# EAGLE schematic hanover-7320-20-01 (EAGLE 9.6.1), part 2 of 4
## Sheet 5 of 7: Dots R1-16 C17-32
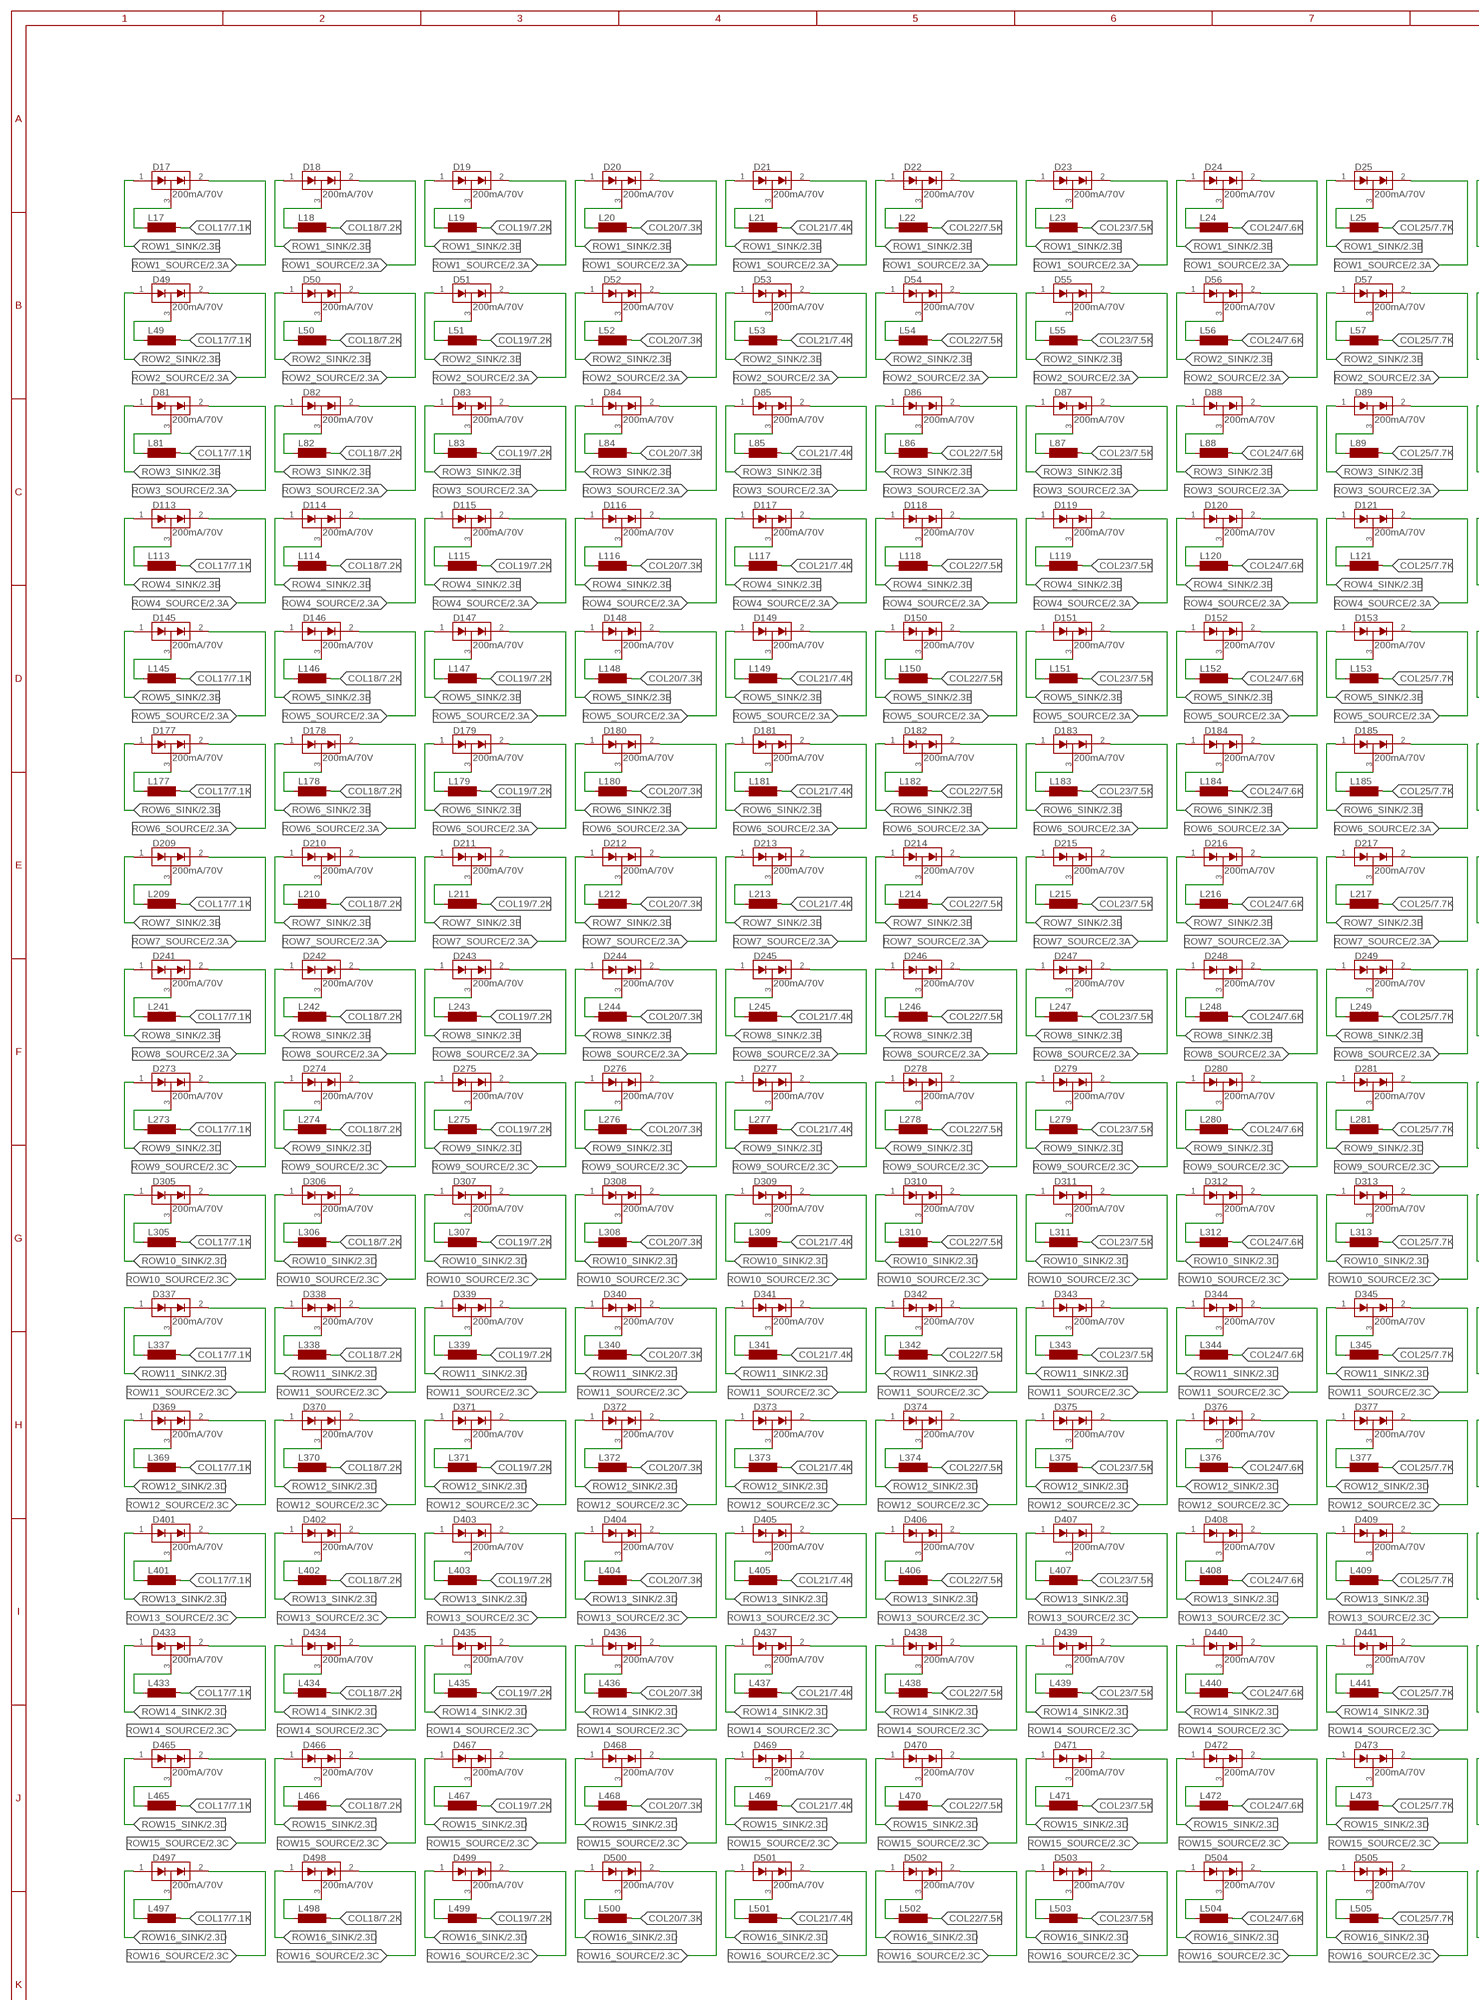
[diagram p6: schematic, sheet 5, part 1 of 3]
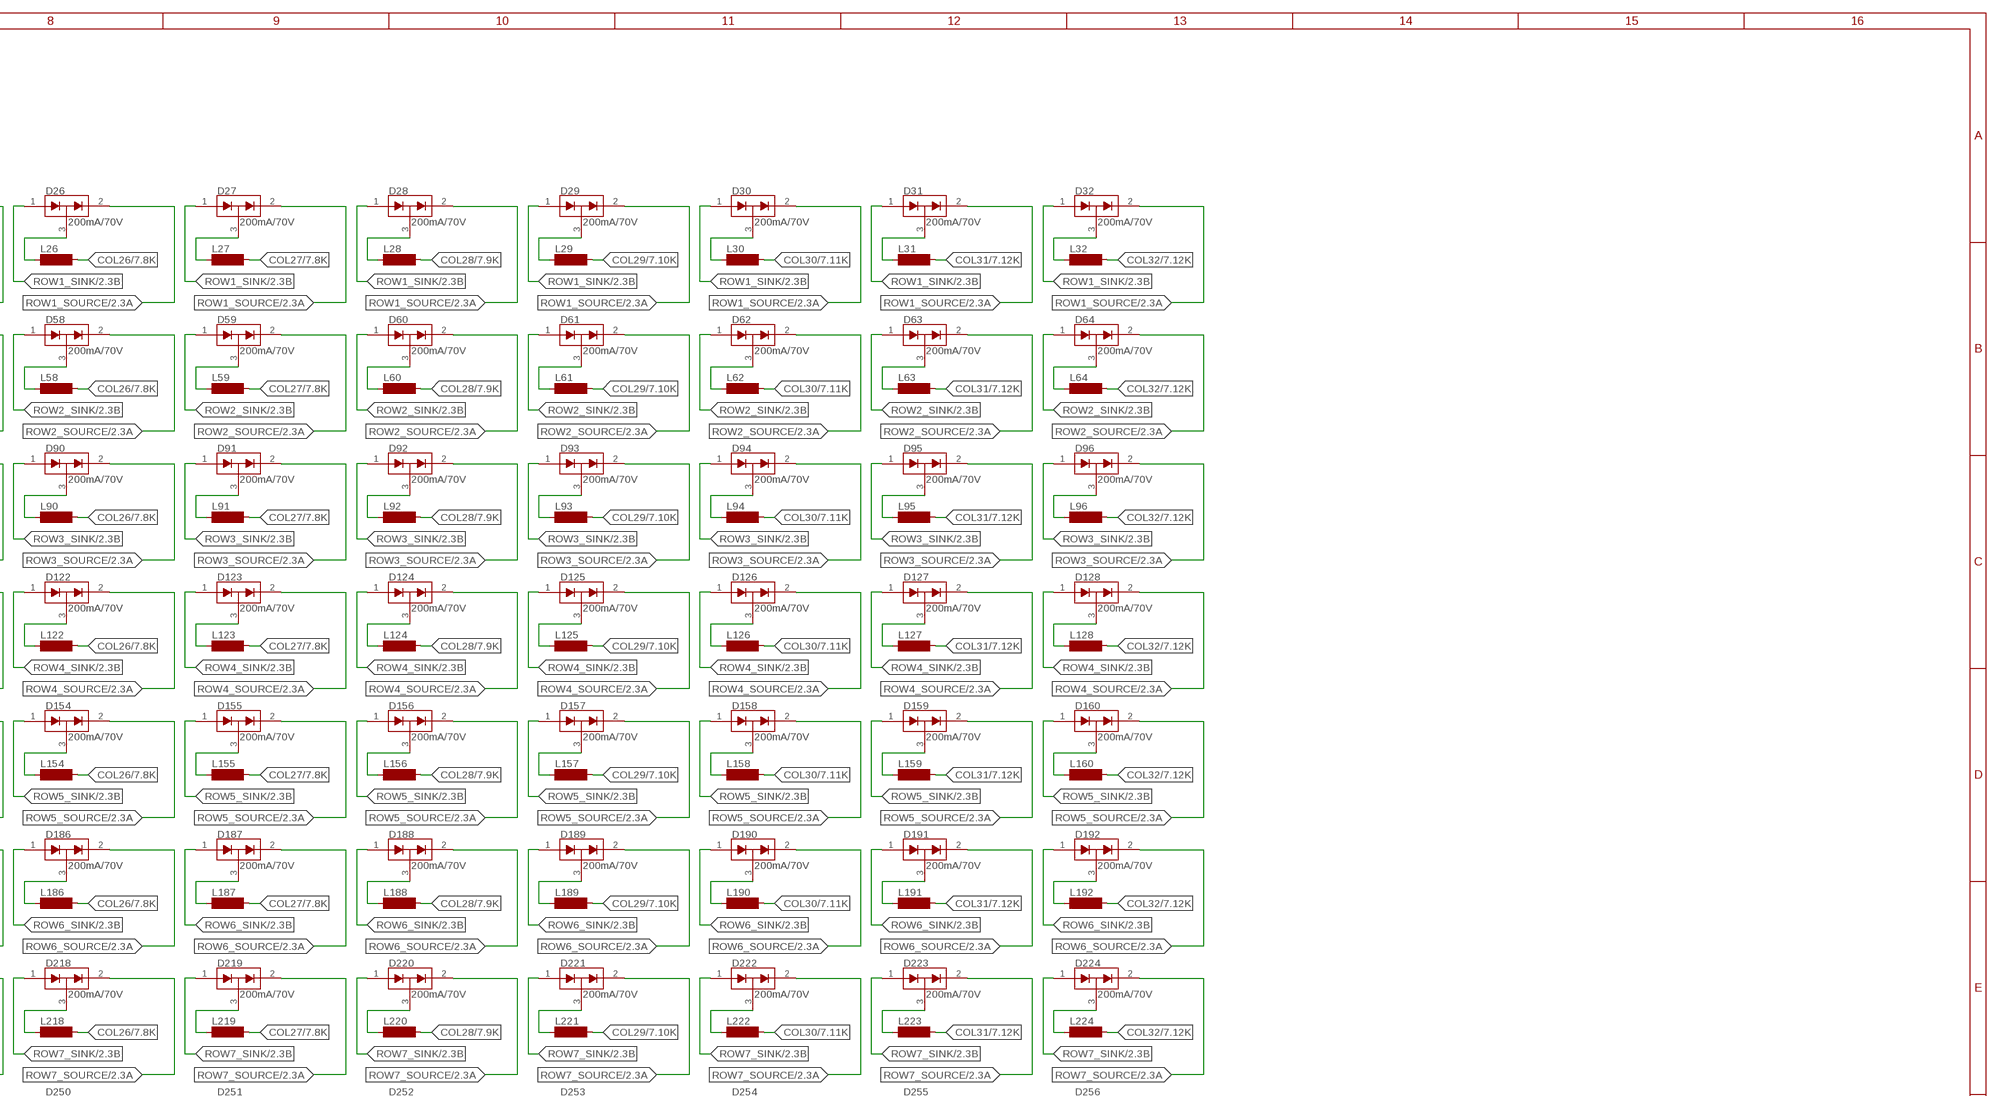
[diagram p7: schematic, sheet 5, part 2 of 3]
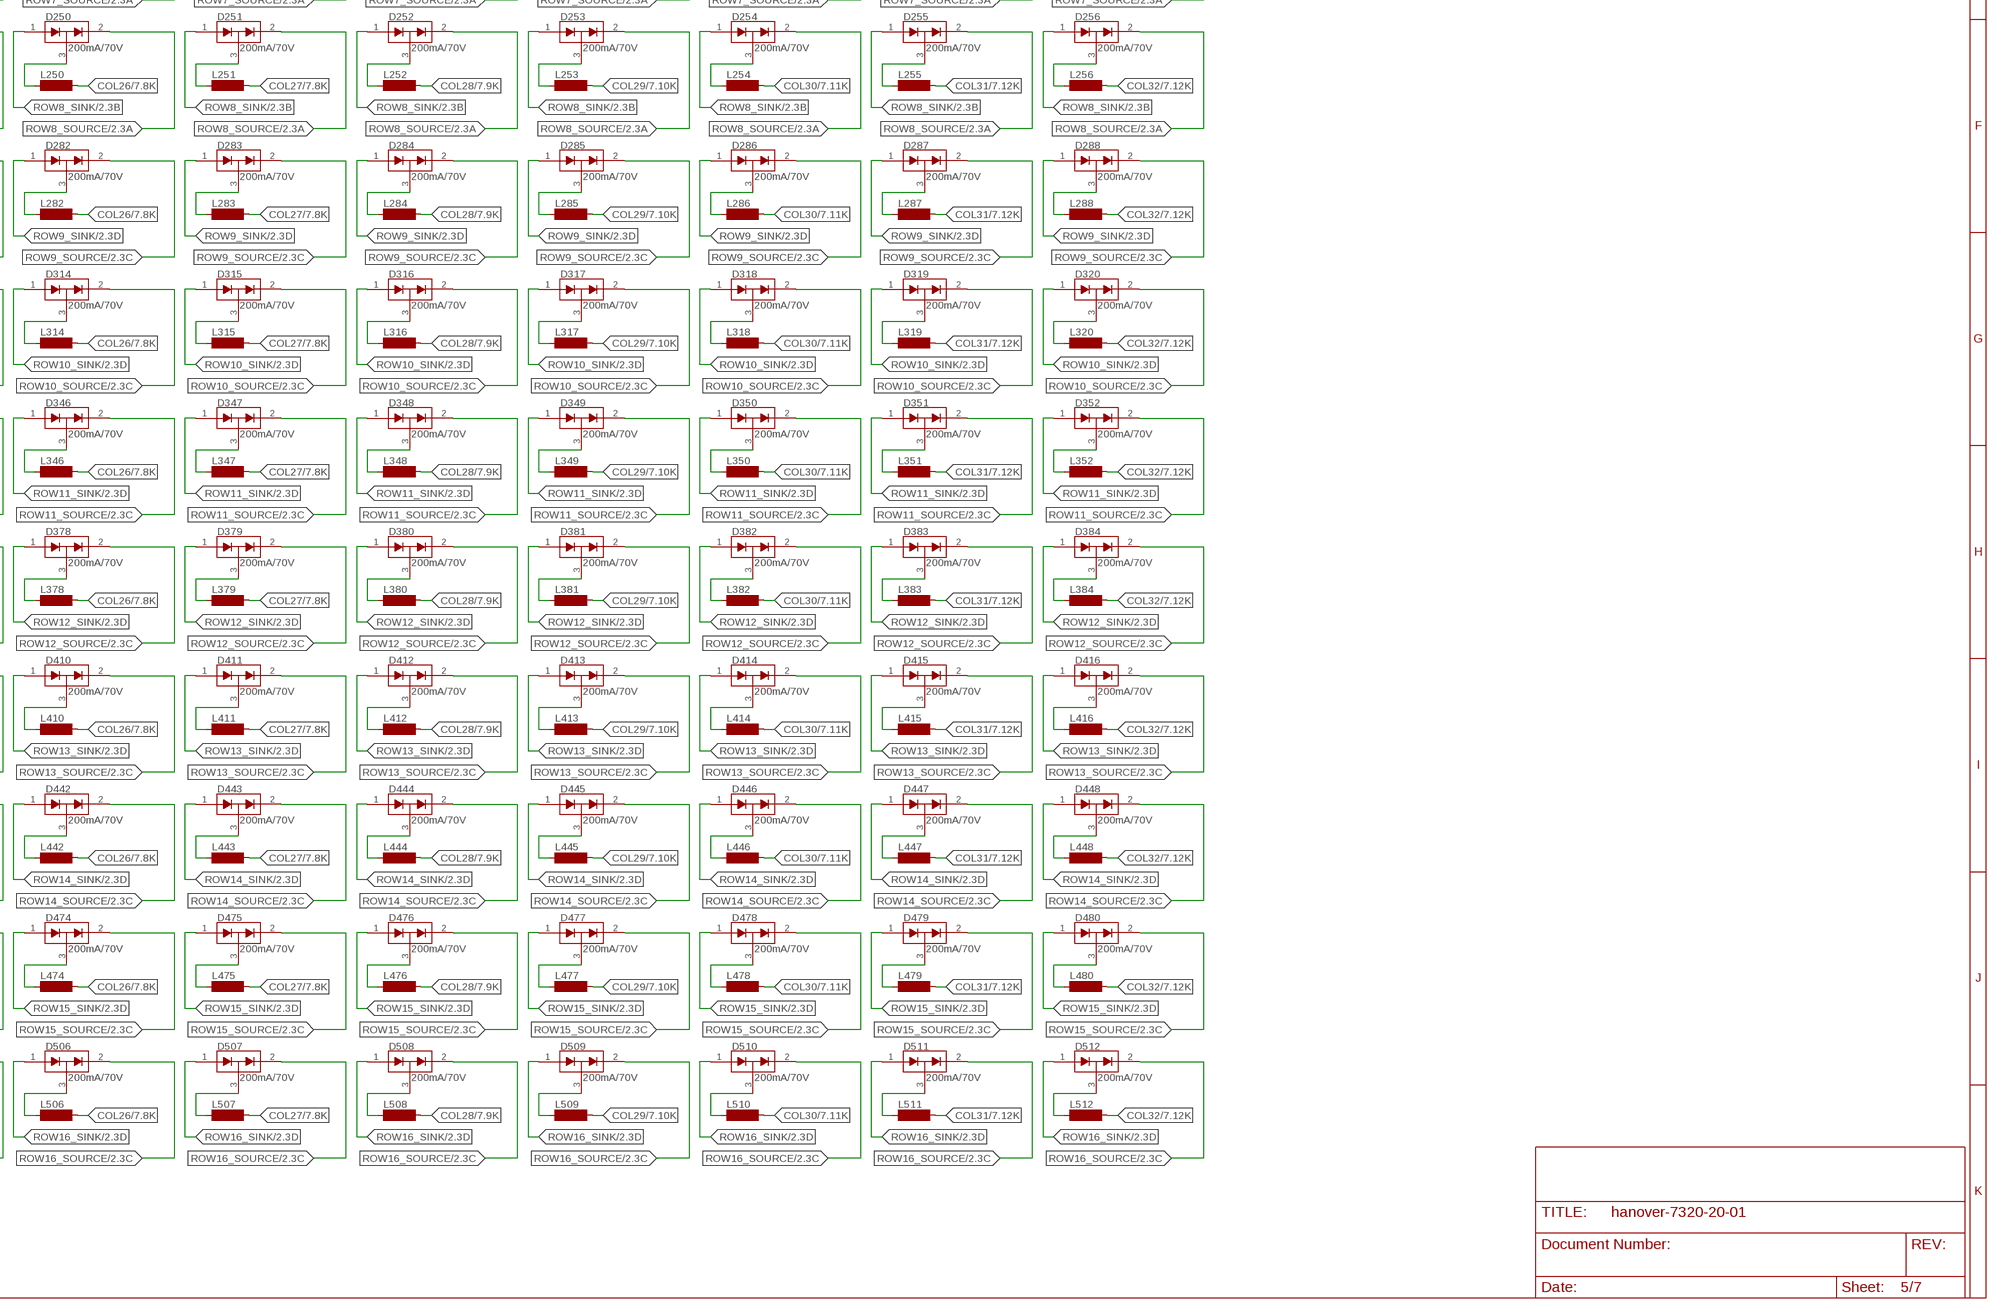
[diagram p8: schematic, sheet 5, part 3 of 3]

### Parts
D17  200mA/70V  BAV99  [SOT23-3]
D18  200mA/70V  BAV99  [SOT23-3]
D19  200mA/70V  BAV99  [SOT23-3]
D20  200mA/70V  BAV99  [SOT23-3]
D21  200mA/70V  BAV99  [SOT23-3]
D22  200mA/70V  BAV99  [SOT23-3]
D23  200mA/70V  BAV99  [SOT23-3]
D24  200mA/70V  BAV99  [SOT23-3]
D25  200mA/70V  BAV99  [SOT23-3]
D26  200mA/70V  BAV99  [SOT23-3]
D27  200mA/70V  BAV99  [SOT23-3]
D28  200mA/70V  BAV99  [SOT23-3]
D29  200mA/70V  BAV99  [SOT23-3]
D30  200mA/70V  BAV99  [SOT23-3]
D31  200mA/70V  BAV99  [SOT23-3]
D32  200mA/70V  BAV99  [SOT23-3]
D49  200mA/70V  BAV99  [SOT23-3]
D50  200mA/70V  BAV99  [SOT23-3]
D51  200mA/70V  BAV99  [SOT23-3]
D52  200mA/70V  BAV99  [SOT23-3]
D53  200mA/70V  BAV99  [SOT23-3]
D54  200mA/70V  BAV99  [SOT23-3]
D55  200mA/70V  BAV99  [SOT23-3]
D56  200mA/70V  BAV99  [SOT23-3]
D57  200mA/70V  BAV99  [SOT23-3]
D58  200mA/70V  BAV99  [SOT23-3]
D59  200mA/70V  BAV99  [SOT23-3]
D60  200mA/70V  BAV99  [SOT23-3]
D61  200mA/70V  BAV99  [SOT23-3]
D62  200mA/70V  BAV99  [SOT23-3]
D63  200mA/70V  BAV99  [SOT23-3]
D64  200mA/70V  BAV99  [SOT23-3]
D81  200mA/70V  BAV99  [SOT23-3]
D82  200mA/70V  BAV99  [SOT23-3]
D83  200mA/70V  BAV99  [SOT23-3]
D84  200mA/70V  BAV99  [SOT23-3]
D85  200mA/70V  BAV99  [SOT23-3]
D86  200mA/70V  BAV99  [SOT23-3]
D87  200mA/70V  BAV99  [SOT23-3]
D88  200mA/70V  BAV99  [SOT23-3]
D89  200mA/70V  BAV99  [SOT23-3]
D90  200mA/70V  BAV99  [SOT23-3]
D91  200mA/70V  BAV99  [SOT23-3]
D92  200mA/70V  BAV99  [SOT23-3]
D93  200mA/70V  BAV99  [SOT23-3]
D94  200mA/70V  BAV99  [SOT23-3]
D95  200mA/70V  BAV99  [SOT23-3]
D96  200mA/70V  BAV99  [SOT23-3]
D113  200mA/70V  BAV99  [SOT23-3]
D114  200mA/70V  BAV99  [SOT23-3]
D115  200mA/70V  BAV99  [SOT23-3]
D116  200mA/70V  BAV99  [SOT23-3]
D117  200mA/70V  BAV99  [SOT23-3]
D118  200mA/70V  BAV99  [SOT23-3]
D119  200mA/70V  BAV99  [SOT23-3]
D120  200mA/70V  BAV99  [SOT23-3]
D121  200mA/70V  BAV99  [SOT23-3]
D122  200mA/70V  BAV99  [SOT23-3]
D123  200mA/70V  BAV99  [SOT23-3]
D124  200mA/70V  BAV99  [SOT23-3]
D125  200mA/70V  BAV99  [SOT23-3]
D126  200mA/70V  BAV99  [SOT23-3]
D127  200mA/70V  BAV99  [SOT23-3]
D128  200mA/70V  BAV99  [SOT23-3]
D145  200mA/70V  BAV99  [SOT23-3]
D146  200mA/70V  BAV99  [SOT23-3]
D147  200mA/70V  BAV99  [SOT23-3]
D148  200mA/70V  BAV99  [SOT23-3]
D149  200mA/70V  BAV99  [SOT23-3]
D150  200mA/70V  BAV99  [SOT23-3]
D151  200mA/70V  BAV99  [SOT23-3]
D152  200mA/70V  BAV99  [SOT23-3]
D153  200mA/70V  BAV99  [SOT23-3]
D154  200mA/70V  BAV99  [SOT23-3]
D155  200mA/70V  BAV99  [SOT23-3]
D156  200mA/70V  BAV99  [SOT23-3]
D157  200mA/70V  BAV99  [SOT23-3]
D158  200mA/70V  BAV99  [SOT23-3]
D159  200mA/70V  BAV99  [SOT23-3]
D160  200mA/70V  BAV99  [SOT23-3]
D177  200mA/70V  BAV99  [SOT23-3]
D178  200mA/70V  BAV99  [SOT23-3]
D179  200mA/70V  BAV99  [SOT23-3]
D180  200mA/70V  BAV99  [SOT23-3]
D181  200mA/70V  BAV99  [SOT23-3]
D182  200mA/70V  BAV99  [SOT23-3]
D183  200mA/70V  BAV99  [SOT23-3]
D184  200mA/70V  BAV99  [SOT23-3]
D185  200mA/70V  BAV99  [SOT23-3]
D186  200mA/70V  BAV99  [SOT23-3]
D187  200mA/70V  BAV99  [SOT23-3]
D188  200mA/70V  BAV99  [SOT23-3]
D189  200mA/70V  BAV99  [SOT23-3]
D190  200mA/70V  BAV99  [SOT23-3]
D191  200mA/70V  BAV99  [SOT23-3]
D192  200mA/70V  BAV99  [SOT23-3]
D209  200mA/70V  BAV99  [SOT23-3]
D210  200mA/70V  BAV99  [SOT23-3]
D211  200mA/70V  BAV99  [SOT23-3]
D212  200mA/70V  BAV99  [SOT23-3]
D213  200mA/70V  BAV99  [SOT23-3]
D214  200mA/70V  BAV99  [SOT23-3]
D215  200mA/70V  BAV99  [SOT23-3]
D216  200mA/70V  BAV99  [SOT23-3]
D217  200mA/70V  BAV99  [SOT23-3]
D218  200mA/70V  BAV99  [SOT23-3]
D219  200mA/70V  BAV99  [SOT23-3]
D220  200mA/70V  BAV99  [SOT23-3]
D221  200mA/70V  BAV99  [SOT23-3]
D222  200mA/70V  BAV99  [SOT23-3]
D223  200mA/70V  BAV99  [SOT23-3]
D224  200mA/70V  BAV99  [SOT23-3]
D241  200mA/70V  BAV99  [SOT23-3]
D242  200mA/70V  BAV99  [SOT23-3]
D243  200mA/70V  BAV99  [SOT23-3]
D244  200mA/70V  BAV99  [SOT23-3]
D245  200mA/70V  BAV99  [SOT23-3]
D246  200mA/70V  BAV99  [SOT23-3]
D247  200mA/70V  BAV99  [SOT23-3]
D248  200mA/70V  BAV99  [SOT23-3]
D249  200mA/70V  BAV99  [SOT23-3]
D250  200mA/70V  BAV99  [SOT23-3]
D251  200mA/70V  BAV99  [SOT23-3]
D252  200mA/70V  BAV99  [SOT23-3]
D253  200mA/70V  BAV99  [SOT23-3]
D254  200mA/70V  BAV99  [SOT23-3]
D255  200mA/70V  BAV99  [SOT23-3]
D256  200mA/70V  BAV99  [SOT23-3]
D273  200mA/70V  BAV99  [SOT23-3]
D274  200mA/70V  BAV99  [SOT23-3]
D275  200mA/70V  BAV99  [SOT23-3]
D276  200mA/70V  BAV99  [SOT23-3]
D277  200mA/70V  BAV99  [SOT23-3]
D278  200mA/70V  BAV99  [SOT23-3]
D279  200mA/70V  BAV99  [SOT23-3]
D280  200mA/70V  BAV99  [SOT23-3]
D281  200mA/70V  BAV99  [SOT23-3]
D282  200mA/70V  BAV99  [SOT23-3]
D283  200mA/70V  BAV99  [SOT23-3]
D284  200mA/70V  BAV99  [SOT23-3]
D285  200mA/70V  BAV99  [SOT23-3]
D286  200mA/70V  BAV99  [SOT23-3]
D287  200mA/70V  BAV99  [SOT23-3]
D288  200mA/70V  BAV99  [SOT23-3]
D305  200mA/70V  BAV99  [SOT23-3]
D306  200mA/70V  BAV99  [SOT23-3]
D307  200mA/70V  BAV99  [SOT23-3]
D308  200mA/70V  BAV99  [SOT23-3]
D309  200mA/70V  BAV99  [SOT23-3]
D310  200mA/70V  BAV99  [SOT23-3]
D311  200mA/70V  BAV99  [SOT23-3]
D312  200mA/70V  BAV99  [SOT23-3]
D313  200mA/70V  BAV99  [SOT23-3]
D314  200mA/70V  BAV99  [SOT23-3]
D315  200mA/70V  BAV99  [SOT23-3]
D316  200mA/70V  BAV99  [SOT23-3]
D317  200mA/70V  BAV99  [SOT23-3]
D318  200mA/70V  BAV99  [SOT23-3]
D319  200mA/70V  BAV99  [SOT23-3]
D320  200mA/70V  BAV99  [SOT23-3]
D337  200mA/70V  BAV99  [SOT23-3]
D338  200mA/70V  BAV99  [SOT23-3]
D339  200mA/70V  BAV99  [SOT23-3]
D340  200mA/70V  BAV99  [SOT23-3]
D341  200mA/70V  BAV99  [SOT23-3]
D342  200mA/70V  BAV99  [SOT23-3]
D343  200mA/70V  BAV99  [SOT23-3]
D344  200mA/70V  BAV99  [SOT23-3]
D345  200mA/70V  BAV99  [SOT23-3]
D346  200mA/70V  BAV99  [SOT23-3]
D347  200mA/70V  BAV99  [SOT23-3]
D348  200mA/70V  BAV99  [SOT23-3]
D349  200mA/70V  BAV99  [SOT23-3]
D350  200mA/70V  BAV99  [SOT23-3]
D351  200mA/70V  BAV99  [SOT23-3]
D352  200mA/70V  BAV99  [SOT23-3]
D369  200mA/70V  BAV99  [SOT23-3]
D370  200mA/70V  BAV99  [SOT23-3]
D371  200mA/70V  BAV99  [SOT23-3]
D372  200mA/70V  BAV99  [SOT23-3]
D373  200mA/70V  BAV99  [SOT23-3]
D374  200mA/70V  BAV99  [SOT23-3]
D375  200mA/70V  BAV99  [SOT23-3]
D376  200mA/70V  BAV99  [SOT23-3]
D377  200mA/70V  BAV99  [SOT23-3]
D378  200mA/70V  BAV99  [SOT23-3]
D379  200mA/70V  BAV99  [SOT23-3]
D380  200mA/70V  BAV99  [SOT23-3]
D381  200mA/70V  BAV99  [SOT23-3]
D382  200mA/70V  BAV99  [SOT23-3]
D383  200mA/70V  BAV99  [SOT23-3]
D384  200mA/70V  BAV99  [SOT23-3]
D401  200mA/70V  BAV99  [SOT23-3]
D402  200mA/70V  BAV99  [SOT23-3]
D403  200mA/70V  BAV99  [SOT23-3]
D404  200mA/70V  BAV99  [SOT23-3]
D405  200mA/70V  BAV99  [SOT23-3]
D406  200mA/70V  BAV99  [SOT23-3]
D407  200mA/70V  BAV99  [SOT23-3]
D408  200mA/70V  BAV99  [SOT23-3]
D409  200mA/70V  BAV99  [SOT23-3]
D410  200mA/70V  BAV99  [SOT23-3]
D411  200mA/70V  BAV99  [SOT23-3]
D412  200mA/70V  BAV99  [SOT23-3]
D413  200mA/70V  BAV99  [SOT23-3]
D414  200mA/70V  BAV99  [SOT23-3]
D415  200mA/70V  BAV99  [SOT23-3]
D416  200mA/70V  BAV99  [SOT23-3]
D433  200mA/70V  BAV99  [SOT23-3]
D434  200mA/70V  BAV99  [SOT23-3]
D435  200mA/70V  BAV99  [SOT23-3]
D436  200mA/70V  BAV99  [SOT23-3]
D437  200mA/70V  BAV99  [SOT23-3]
D438  200mA/70V  BAV99  [SOT23-3]
D439  200mA/70V  BAV99  [SOT23-3]
D440  200mA/70V  BAV99  [SOT23-3]
D441  200mA/70V  BAV99  [SOT23-3]
D442  200mA/70V  BAV99  [SOT23-3]
D443  200mA/70V  BAV99  [SOT23-3]
D444  200mA/70V  BAV99  [SOT23-3]
D445  200mA/70V  BAV99  [SOT23-3]
D446  200mA/70V  BAV99  [SOT23-3]
D447  200mA/70V  BAV99  [SOT23-3]
D448  200mA/70V  BAV99  [SOT23-3]
D465  200mA/70V  BAV99  [SOT23-3]
D466  200mA/70V  BAV99  [SOT23-3]
D467  200mA/70V  BAV99  [SOT23-3]
D468  200mA/70V  BAV99  [SOT23-3]
D469  200mA/70V  BAV99  [SOT23-3]
D470  200mA/70V  BAV99  [SOT23-3]
D471  200mA/70V  BAV99  [SOT23-3]
D472  200mA/70V  BAV99  [SOT23-3]
D473  200mA/70V  BAV99  [SOT23-3]
D474  200mA/70V  BAV99  [SOT23-3]
D475  200mA/70V  BAV99  [SOT23-3]
D476  200mA/70V  BAV99  [SOT23-3]
D477  200mA/70V  BAV99  [SOT23-3]
D478  200mA/70V  BAV99  [SOT23-3]
D479  200mA/70V  BAV99  [SOT23-3]
D480  200mA/70V  BAV99  [SOT23-3]
D497  200mA/70V  BAV99  [SOT23-3]
D498  200mA/70V  BAV99  [SOT23-3]
D499  200mA/70V  BAV99  [SOT23-3]
D500  200mA/70V  BAV99  [SOT23-3]
D501  200mA/70V  BAV99  [SOT23-3]
D502  200mA/70V  BAV99  [SOT23-3]
D503  200mA/70V  BAV99  [SOT23-3]
D504  200mA/70V  BAV99  [SOT23-3]
D505  200mA/70V  BAV99  [SOT23-3]
D506  200mA/70V  BAV99  [SOT23-3]
D507  200mA/70V  BAV99  [SOT23-3]
D508  200mA/70V  BAV99  [SOT23-3]
D509  200mA/70V  BAV99  [SOT23-3]
D510  200mA/70V  BAV99  [SOT23-3]
D511  200mA/70V  BAV99  [SOT23-3]
D512  200mA/70V  BAV99  [SOT23-3]
L17  SD8  [SD8]
L18  SD8  [SD8]
L19  SD8  [SD8]
L20  SD8  [SD8]
L21  SD8  [SD8]
L22  SD8  [SD8]
L23  SD8  [SD8]
L24  SD8  [SD8]
L25  SD8  [SD8]
L26  SD8  [SD8]
L27  SD8  [SD8]
L28  SD8  [SD8]
L29  SD8  [SD8]
L30  SD8  [SD8]
L31  SD8  [SD8]
L32  SD8  [SD8]
L49  SD8  [SD8]
L50  SD8  [SD8]
L51  SD8  [SD8]
L52  SD8  [SD8]
L53  SD8  [SD8]
L54  SD8  [SD8]
L55  SD8  [SD8]
L56  SD8  [SD8]
L57  SD8  [SD8]
L58  SD8  [SD8]
L59  SD8  [SD8]
L60  SD8  [SD8]
L61  SD8  [SD8]
L62  SD8  [SD8]
L63  SD8  [SD8]
L64  SD8  [SD8]
L81  SD8  [SD8]
L82  SD8  [SD8]
L83  SD8  [SD8]
L84  SD8  [SD8]
L85  SD8  [SD8]
L86  SD8  [SD8]
L87  SD8  [SD8]
L88  SD8  [SD8]
L89  SD8  [SD8]
L90  SD8  [SD8]
L91  SD8  [SD8]
L92  SD8  [SD8]
L93  SD8  [SD8]
L94  SD8  [SD8]
L95  SD8  [SD8]
L96  SD8  [SD8]
L113  SD8  [SD8]
L114  SD8  [SD8]
L115  SD8  [SD8]
L116  SD8  [SD8]
L117  SD8  [SD8]
L118  SD8  [SD8]
L119  SD8  [SD8]
L120  SD8  [SD8]
L121  SD8  [SD8]
L122  SD8  [SD8]
L123  SD8  [SD8]
L124  SD8  [SD8]
L125  SD8  [SD8]
L126  SD8  [SD8]
L127  SD8  [SD8]
L128  SD8  [SD8]
L145  SD8  [SD8]
L146  SD8  [SD8]
L147  SD8  [SD8]
L148  SD8  [SD8]
L149  SD8  [SD8]
L150  SD8  [SD8]
L151  SD8  [SD8]
L152  SD8  [SD8]
L153  SD8  [SD8]
L154  SD8  [SD8]
L155  SD8  [SD8]
L156  SD8  [SD8]
L157  SD8  [SD8]
L158  SD8  [SD8]
L159  SD8  [SD8]
L160  SD8  [SD8]
L177  SD8  [SD8]
L178  SD8  [SD8]
L179  SD8  [SD8]
L180  SD8  [SD8]
L181  SD8  [SD8]
L182  SD8  [SD8]
L183  SD8  [SD8]
L184  SD8  [SD8]
L185  SD8  [SD8]
L186  SD8  [SD8]
L187  SD8  [SD8]
L188  SD8  [SD8]
L189  SD8  [SD8]
L190  SD8  [SD8]
L191  SD8  [SD8]
L192  SD8  [SD8]
L209  SD8  [SD8]
L210  SD8  [SD8]
L211  SD8  [SD8]
L212  SD8  [SD8]
L213  SD8  [SD8]
L214  SD8  [SD8]
L215  SD8  [SD8]
L216  SD8  [SD8]
L217  SD8  [SD8]
L218  SD8  [SD8]
L219  SD8  [SD8]
L220  SD8  [SD8]
L221  SD8  [SD8]
L222  SD8  [SD8]
L223  SD8  [SD8]
L224  SD8  [SD8]
L241  SD8  [SD8]
L242  SD8  [SD8]
L243  SD8  [SD8]
L244  SD8  [SD8]
L245  SD8  [SD8]
L246  SD8  [SD8]
L247  SD8  [SD8]
L248  SD8  [SD8]
L249  SD8  [SD8]
L250  SD8  [SD8]
L251  SD8  [SD8]
L252  SD8  [SD8]
L253  SD8  [SD8]
L254  SD8  [SD8]
L255  SD8  [SD8]
L256  SD8  [SD8]
L273  SD8  [SD8]
L274  SD8  [SD8]
L275  SD8  [SD8]
L276  SD8  [SD8]
L277  SD8  [SD8]
L278  SD8  [SD8]
L279  SD8  [SD8]
L280  SD8  [SD8]
L281  SD8  [SD8]
L282  SD8  [SD8]
L283  SD8  [SD8]
L284  SD8  [SD8]
L285  SD8  [SD8]
L286  SD8  [SD8]
L287  SD8  [SD8]
L288  SD8  [SD8]
L305  SD8  [SD8]
L306  SD8  [SD8]
L307  SD8  [SD8]
L308  SD8  [SD8]
L309  SD8  [SD8]
L310  SD8  [SD8]
L311  SD8  [SD8]
L312  SD8  [SD8]
L313  SD8  [SD8]
L314  SD8  [SD8]
L315  SD8  [SD8]
L316  SD8  [SD8]
L317  SD8  [SD8]
L318  SD8  [SD8]
L319  SD8  [SD8]
L320  SD8  [SD8]
L337  SD8  [SD8]
L338  SD8  [SD8]
L339  SD8  [SD8]
L340  SD8  [SD8]
L341  SD8  [SD8]
L342  SD8  [SD8]
L343  SD8  [SD8]
L344  SD8  [SD8]
L345  SD8  [SD8]
L346  SD8  [SD8]
L347  SD8  [SD8]
L348  SD8  [SD8]
L349  SD8  [SD8]
L350  SD8  [SD8]
L351  SD8  [SD8]
L352  SD8  [SD8]
L369  SD8  [SD8]
L370  SD8  [SD8]
L371  SD8  [SD8]
L372  SD8  [SD8]
L373  SD8  [SD8]
L374  SD8  [SD8]
L375  SD8  [SD8]
L376  SD8  [SD8]
L377  SD8  [SD8]
L378  SD8  [SD8]
L379  SD8  [SD8]
L380  SD8  [SD8]
L381  SD8  [SD8]
L382  SD8  [SD8]
L383  SD8  [SD8]
L384  SD8  [SD8]
L401  SD8  [SD8]
L402  SD8  [SD8]
L403  SD8  [SD8]
L404  SD8  [SD8]
L405  SD8  [SD8]
L406  SD8  [SD8]
L407  SD8  [SD8]
L408  SD8  [SD8]
L409  SD8  [SD8]
L410  SD8  [SD8]
L411  SD8  [SD8]
L412  SD8  [SD8]
L413  SD8  [SD8]
L414  SD8  [SD8]
L415  SD8  [SD8]
L416  SD8  [SD8]
L433  SD8  [SD8]
L434  SD8  [SD8]
L435  SD8  [SD8]
L436  SD8  [SD8]
L437  SD8  [SD8]
L438  SD8  [SD8]
L439  SD8  [SD8]
L440  SD8  [SD8]
L441  SD8  [SD8]
L442  SD8  [SD8]
L443  SD8  [SD8]
L444  SD8  [SD8]
L445  SD8  [SD8]
L446  SD8  [SD8]
L447  SD8  [SD8]
L448  SD8  [SD8]
L465  SD8  [SD8]
L466  SD8  [SD8]
L467  SD8  [SD8]
L468  SD8  [SD8]
L469  SD8  [SD8]
L470  SD8  [SD8]
L471  SD8  [SD8]
L472  SD8  [SD8]
L473  SD8  [SD8]
L474  SD8  [SD8]
L475  SD8  [SD8]
L476  SD8  [SD8]
L477  SD8  [SD8]
L478  SD8  [SD8]
L479  SD8  [SD8]
L480  SD8  [SD8]
L497  SD8  [SD8]
L498  SD8  [SD8]
L499  SD8  [SD8]
L500  SD8  [SD8]
L501  SD8  [SD8]
L502  SD8  [SD8]
L503  SD8  [SD8]
L504  SD8  [SD8]
L505  SD8  [SD8]
L506  SD8  [SD8]
L507  SD8  [SD8]
L508  SD8  [SD8]
L509  SD8  [SD8]
L510  SD8  [SD8]
L511  SD8  [SD8]
L512  SD8  [SD8]

### Nets
COL17: L17.2 L49.2 L81.2 L113.2 L145.2 L177.2 L209.2 L241.2 L273.2 L305.2 L337.2 L369.2 L401.2 L433.2 L465.2 L497.2 ; also sheet 3,7
COL18: L18.2 L50.2 L82.2 L114.2 L146.2 L178.2 L210.2 L242.2 L274.2 L306.2 L338.2 L370.2 L402.2 L434.2 L466.2 L498.2 ; also sheet 3,7
COL19: L19.2 L51.2 L83.2 L115.2 L147.2 L179.2 L211.2 L243.2 L275.2 L307.2 L339.2 L371.2 L403.2 L435.2 L467.2 L499.2 ; also sheet 3,7
COL20: L20.2 L52.2 L84.2 L116.2 L148.2 L180.2 L212.2 L244.2 L276.2 L308.2 L340.2 L372.2 L404.2 L436.2 L468.2 L500.2 ; also sheet 3,7
COL21: L21.2 L53.2 L85.2 L117.2 L149.2 L181.2 L213.2 L245.2 L277.2 L309.2 L341.2 L373.2 L405.2 L437.2 L469.2 L501.2 ; also sheet 3,7
COL22: L22.2 L54.2 L86.2 L118.2 L150.2 L182.2 L214.2 L246.2 L278.2 L310.2 L342.2 L374.2 L406.2 L438.2 L470.2 L502.2 ; also sheet 3,7
COL23: L23.2 L55.2 L87.2 L119.2 L151.2 L183.2 L215.2 L247.2 L279.2 L311.2 L343.2 L375.2 L407.2 L439.2 L471.2 L503.2 ; also sheet 3,7
COL24: L24.2 L56.2 L88.2 L120.2 L152.2 L184.2 L216.2 L248.2 L280.2 L312.2 L344.2 L376.2 L408.2 L440.2 L472.2 L504.2 ; also sheet 3,7
COL25: L25.2 L57.2 L89.2 L121.2 L153.2 L185.2 L217.2 L249.2 L281.2 L313.2 L345.2 L377.2 L409.2 L441.2 L473.2 L505.2 ; also sheet 3,7
COL26: L26.2 L58.2 L90.2 L122.2 L154.2 L186.2 L218.2 L250.2 L282.2 L314.2 L346.2 L378.2 L410.2 L442.2 L474.2 L506.2 ; also sheet 3,7
COL27: L27.2 L59.2 L91.2 L123.2 L155.2 L187.2 L219.2 L251.2 L283.2 L315.2 L347.2 L379.2 L411.2 L443.2 L475.2 L507.2 ; also sheet 3,7
COL28: L28.2 L60.2 L92.2 L124.2 L156.2 L188.2 L220.2 L252.2 L284.2 L316.2 L348.2 L380.2 L412.2 L444.2 L476.2 L508.2 ; also sheet 3,7
COL29: L29.2 L61.2 L93.2 L125.2 L157.2 L189.2 L221.2 L253.2 L285.2 L317.2 L349.2 L381.2 L413.2 L445.2 L477.2 L509.2 ; also sheet 3,7
COL30: L30.2 L62.2 L94.2 L126.2 L158.2 L190.2 L222.2 L254.2 L286.2 L318.2 L350.2 L382.2 L414.2 L446.2 L478.2 L510.2 ; also sheet 3,7
COL31: L31.2 L63.2 L95.2 L127.2 L159.2 L191.2 L223.2 L255.2 L287.2 L319.2 L351.2 L383.2 L415.2 L447.2 L479.2 L511.2 ; also sheet 3,7
COL32: L32.2 L64.2 L96.2 L128.2 L160.2 L192.2 L224.2 L256.2 L288.2 L320.2 L352.2 L384.2 L416.2 L448.2 L480.2 L512.2 ; also sheet 3,7
N$30: D17.3(COM) L17.1
N$31: D18.3(COM) L18.1
N$32: D19.3(COM) L19.1
N$33: D20.3(COM) L20.1
N$35: D21.3(COM) L21.1
N$36: D22.3(COM) L22.1
N$37: D23.3(COM) L23.1
N$38: D24.3(COM) L24.1
N$39: D25.3(COM) L25.1
N$40: D26.3(COM) L26.1
N$41: D27.3(COM) L27.1
N$42: D28.3(COM) L28.1
N$43: D29.3(COM) L29.1
N$44: D30.3(COM) L30.1
N$45: D31.3(COM) L31.1
N$46: D32.3(COM) L32.1
N$63: D49.3(COM) L49.1
N$64: D50.3(COM) L50.1
N$65: D51.3(COM) L51.1
N$66: D52.3(COM) L52.1
N$67: D53.3(COM) L53.1
N$68: D54.3(COM) L54.1
N$69: D55.3(COM) L55.1
N$70: D56.3(COM) L56.1
N$71: D57.3(COM) L57.1
N$72: D58.3(COM) L58.1
N$73: D59.3(COM) L59.1
N$74: D60.3(COM) L60.1
N$75: D61.3(COM) L61.1
N$76: D62.3(COM) L62.1
N$77: D63.3(COM) L63.1
N$78: D64.3(COM) L64.1
N$95: D81.3(COM) L81.1
N$96: D82.3(COM) L82.1
N$97: D83.3(COM) L83.1
N$98: D84.3(COM) L84.1
N$99: D85.3(COM) L85.1
N$100: D86.3(COM) L86.1
N$101: D87.3(COM) L87.1
N$102: D88.3(COM) L88.1
N$103: D89.3(COM) L89.1
N$104: D90.3(COM) L90.1
N$105: D91.3(COM) L91.1
N$106: D92.3(COM) L92.1
N$107: D93.3(COM) L93.1
N$108: D94.3(COM) L94.1
N$109: D95.3(COM) L95.1
N$110: D96.3(COM) L96.1
N$127: D113.3(COM) L113.1
N$128: D114.3(COM) L114.1
N$129: D115.3(COM) L115.1
N$130: D116.3(COM) L116.1
N$131: D117.3(COM) L117.1
N$132: D118.3(COM) L118.1
N$133: D119.3(COM) L119.1
N$134: D120.3(COM) L120.1
N$135: D121.3(COM) L121.1
N$136: D122.3(COM) L122.1
N$137: D123.3(COM) L123.1
N$138: D124.3(COM) L124.1
N$139: D125.3(COM) L125.1
N$140: D126.3(COM) L126.1
N$141: D127.3(COM) L127.1
N$142: D128.3(COM) L128.1
N$159: D145.3(COM) L145.1
N$160: D146.3(COM) L146.1
N$161: D147.3(COM) L147.1
N$162: D148.3(COM) L148.1
N$163: D149.3(COM) L149.1
N$164: D150.3(COM) L150.1
N$165: D151.3(COM) L151.1
N$166: D152.3(COM) L152.1
N$167: D153.3(COM) L153.1
N$168: D154.3(COM) L154.1
N$169: D155.3(COM) L155.1
N$170: D156.3(COM) L156.1
N$171: D157.3(COM) L157.1
N$172: D158.3(COM) L158.1
N$173: D159.3(COM) L159.1
N$174: D160.3(COM) L160.1
N$191: D177.3(COM) L177.1
N$192: D178.3(COM) L178.1
N$193: D179.3(COM) L179.1
N$194: D180.3(COM) L180.1
N$195: D181.3(COM) L181.1
N$196: D182.3(COM) L182.1
N$197: D183.3(COM) L183.1
N$198: D184.3(COM) L184.1
N$199: D185.3(COM) L185.1
N$200: D186.3(COM) L186.1
N$201: D187.3(COM) L187.1
N$202: D188.3(COM) L188.1
N$203: D189.3(COM) L189.1
N$204: D190.3(COM) L190.1
N$205: D191.3(COM) L191.1
N$206: D192.3(COM) L192.1
N$223: D209.3(COM) L209.1
N$224: D210.3(COM) L210.1
N$225: D211.3(COM) L211.1
N$226: D212.3(COM) L212.1
N$227: D213.3(COM) L213.1
N$228: D214.3(COM) L214.1
N$229: D215.3(COM) L215.1
N$230: D216.3(COM) L216.1
N$231: D217.3(COM) L217.1
N$232: D218.3(COM) L218.1
N$233: D219.3(COM) L219.1
N$234: D220.3(COM) L220.1
N$235: D221.3(COM) L221.1
N$236: D222.3(COM) L222.1
N$237: D223.3(COM) L223.1
N$238: D224.3(COM) L224.1
N$255: D241.3(COM) L241.1
N$256: D242.3(COM) L242.1
N$257: D243.3(COM) L243.1
N$258: D244.3(COM) L244.1
N$259: D245.3(COM) L245.1
N$260: D246.3(COM) L246.1
N$261: D247.3(COM) L247.1
N$262: D248.3(COM) L248.1
N$263: D249.3(COM) L249.1
N$264: D250.3(COM) L250.1
N$265: D251.3(COM) L251.1
N$266: D252.3(COM) L252.1
N$267: D253.3(COM) L253.1
N$268: D254.3(COM) L254.1
N$269: D255.3(COM) L255.1
N$270: D256.3(COM) L256.1
N$287: D273.3(COM) L273.1
N$288: D274.3(COM) L274.1
N$289: D275.3(COM) L275.1
N$290: D276.3(COM) L276.1
N$291: D277.3(COM) L277.1
N$292: D278.3(COM) L278.1
N$293: D279.3(COM) L279.1
N$294: D280.3(COM) L280.1
N$295: D281.3(COM) L281.1
N$296: D282.3(COM) L282.1
N$297: D283.3(COM) L283.1
N$298: D284.3(COM) L284.1
N$299: D285.3(COM) L285.1
N$300: D286.3(COM) L286.1
N$301: D287.3(COM) L287.1
N$302: D288.3(COM) L288.1
N$319: D305.3(COM) L305.1
N$320: D306.3(COM) L306.1
N$321: D307.3(COM) L307.1
N$322: D308.3(COM) L308.1
N$323: D309.3(COM) L309.1
N$324: D310.3(COM) L310.1
N$325: D311.3(COM) L311.1
N$326: D312.3(COM) L312.1
N$327: D313.3(COM) L313.1
N$328: D314.3(COM) L314.1
N$329: D315.3(COM) L315.1
N$330: D316.3(COM) L316.1
N$331: D317.3(COM) L317.1
N$332: D318.3(COM) L318.1
N$333: D319.3(COM) L319.1
N$334: D320.3(COM) L320.1
N$351: D337.3(COM) L337.1
N$352: D338.3(COM) L338.1
N$353: D339.3(COM) L339.1
N$354: D340.3(COM) L340.1
N$355: D341.3(COM) L341.1
N$356: D342.3(COM) L342.1
N$357: D343.3(COM) L343.1
N$358: D344.3(COM) L344.1
N$359: D345.3(COM) L345.1
N$360: D346.3(COM) L346.1
N$361: D347.3(COM) L347.1
N$362: D348.3(COM) L348.1
N$363: D349.3(COM) L349.1
N$364: D350.3(COM) L350.1
N$365: D351.3(COM) L351.1
N$366: D352.3(COM) L352.1
N$383: D369.3(COM) L369.1
N$384: D370.3(COM) L370.1
N$385: D371.3(COM) L371.1
N$386: D372.3(COM) L372.1
N$387: D373.3(COM) L373.1
N$388: D374.3(COM) L374.1
N$389: D375.3(COM) L375.1
N$390: D376.3(COM) L376.1
N$391: D377.3(COM) L377.1
N$392: D378.3(COM) L378.1
N$393: D379.3(COM) L379.1
N$394: D380.3(COM) L380.1
N$395: D381.3(COM) L381.1
N$396: D382.3(COM) L382.1
N$397: D383.3(COM) L383.1
N$398: D384.3(COM) L384.1
N$415: D401.3(COM) L401.1
N$416: D402.3(COM) L402.1
N$417: D403.3(COM) L403.1
N$418: D404.3(COM) L404.1
N$419: D405.3(COM) L405.1
N$420: D406.3(COM) L406.1
N$421: D407.3(COM) L407.1
N$422: D408.3(COM) L408.1
N$423: D409.3(COM) L409.1
N$424: D410.3(COM) L410.1
N$425: D411.3(COM) L411.1
N$426: D412.3(COM) L412.1
N$427: D413.3(COM) L413.1
N$428: D414.3(COM) L414.1
N$429: D415.3(COM) L415.1
N$430: D416.3(COM) L416.1
N$447: D433.3(COM) L433.1
N$448: D434.3(COM) L434.1
N$449: D435.3(COM) L435.1
N$450: D436.3(COM) L436.1
N$451: D437.3(COM) L437.1
N$452: D438.3(COM) L438.1
N$453: D439.3(COM) L439.1
N$454: D440.3(COM) L440.1
N$455: D441.3(COM) L441.1
N$456: D442.3(COM) L442.1
N$457: D443.3(COM) L443.1
N$458: D444.3(COM) L444.1
N$459: D445.3(COM) L445.1
N$460: D446.3(COM) L446.1
N$461: D447.3(COM) L447.1
N$462: D448.3(COM) L448.1
N$479: D465.3(COM) L465.1
N$480: D466.3(COM) L466.1
N$481: D467.3(COM) L467.1
N$482: D468.3(COM) L468.1
N$483: D469.3(COM) L469.1
N$484: D470.3(COM) L470.1
N$485: D471.3(COM) L471.1
N$486: D472.3(COM) L472.1
N$487: D473.3(COM) L473.1
N$488: D474.3(COM) L474.1
N$489: D475.3(COM) L475.1
N$490: D476.3(COM) L476.1
N$491: D477.3(COM) L477.1
N$492: D478.3(COM) L478.1
N$493: D479.3(COM) L479.1
N$494: D480.3(COM) L480.1
N$511: D497.3(COM) L497.1
N$512: D498.3(COM) L498.1
N$513: D499.3(COM) L499.1
N$514: D500.3(COM) L500.1
N$515: D501.3(COM) L501.1
N$516: D502.3(COM) L502.1
N$517: D503.3(COM) L503.1
N$518: D504.3(COM) L504.1
N$519: D505.3(COM) L505.1
N$520: D506.3(COM) L506.1
N$521: D507.3(COM) L507.1
N$522: D508.3(COM) L508.1
N$523: D509.3(COM) L509.1
N$524: D510.3(COM) L510.1
N$525: D511.3(COM) L511.1
N$526: D512.3(COM) L512.1
ROW1_SINK: D17.1(A1) D18.1(A1) D19.1(A1) D20.1(A1) D21.1(A1) D22.1(A1) D23.1(A1) D24.1(A1) D25.1(A1) D26.1(A1) D27.1(A1) D28.1(A1) D29.1(A1) D30.1(A1) D31.1(A1) D32.1(A1) ; also sheet 2,4
ROW1_SOURCE: D17.2(C2) D18.2(C2) D19.2(C2) D20.2(C2) D21.2(C2) D22.2(C2) D23.2(C2) D24.2(C2) D25.2(C2) D26.2(C2) D27.2(C2) D28.2(C2) D29.2(C2) D30.2(C2) D31.2(C2) D32.2(C2) ; also sheet 2,4
ROW2_SINK: D49.1(A1) D50.1(A1) D51.1(A1) D52.1(A1) D53.1(A1) D54.1(A1) D55.1(A1) D56.1(A1) D57.1(A1) D58.1(A1) D59.1(A1) D60.1(A1) D61.1(A1) D62.1(A1) D63.1(A1) D64.1(A1) ; also sheet 2,4
ROW2_SOURCE: D49.2(C2) D50.2(C2) D51.2(C2) D52.2(C2) D53.2(C2) D54.2(C2) D55.2(C2) D56.2(C2) D57.2(C2) D58.2(C2) D59.2(C2) D60.2(C2) D61.2(C2) D62.2(C2) D63.2(C2) D64.2(C2) ; also sheet 2,4
ROW3_SINK: D81.1(A1) D82.1(A1) D83.1(A1) D84.1(A1) D85.1(A1) D86.1(A1) D87.1(A1) D88.1(A1) D89.1(A1) D90.1(A1) D91.1(A1) D92.1(A1) D93.1(A1) D94.1(A1) D95.1(A1) D96.1(A1) ; also sheet 2,4
ROW3_SOURCE: D81.2(C2) D82.2(C2) D83.2(C2) D84.2(C2) D85.2(C2) D86.2(C2) D87.2(C2) D88.2(C2) D89.2(C2) D90.2(C2) D91.2(C2) D92.2(C2) D93.2(C2) D94.2(C2) D95.2(C2) D96.2(C2) ; also sheet 2,4
ROW4_SINK: D113.1(A1) D114.1(A1) D115.1(A1) D116.1(A1) D117.1(A1) D118.1(A1) D119.1(A1) D120.1(A1) D121.1(A1) D122.1(A1) D123.1(A1) D124.1(A1) D125.1(A1) D126.1(A1) D127.1(A1) D128.1(A1) ; also sheet 2,4
ROW4_SOURCE: D113.2(C2) D114.2(C2) D115.2(C2) D116.2(C2) D117.2(C2) D118.2(C2) D119.2(C2) D120.2(C2) D121.2(C2) D122.2(C2) D123.2(C2) D124.2(C2) D125.2(C2) D126.2(C2) D127.2(C2) D128.2(C2) ; also sheet 2,4
ROW5_SINK: D145.1(A1) D146.1(A1) D147.1(A1) D148.1(A1) D149.1(A1) D150.1(A1) D151.1(A1) D152.1(A1) D153.1(A1) D154.1(A1) D155.1(A1) D156.1(A1) D157.1(A1) D158.1(A1) D159.1(A1) D160.1(A1) ; also sheet 2,4
ROW5_SOURCE: D145.2(C2) D146.2(C2) D147.2(C2) D148.2(C2) D149.2(C2) D150.2(C2) D151.2(C2) D152.2(C2) D153.2(C2) D154.2(C2) D155.2(C2) D156.2(C2) D157.2(C2) D158.2(C2) D159.2(C2) D160.2(C2) ; also sheet 2,4
ROW6_SINK: D177.1(A1) D178.1(A1) D179.1(A1) D180.1(A1) D181.1(A1) D182.1(A1) D183.1(A1) D184.1(A1) D185.1(A1) D186.1(A1) D187.1(A1) D188.1(A1) D189.1(A1) D190.1(A1) D191.1(A1) D192.1(A1) ; also sheet 2,4
ROW6_SOURCE: D177.2(C2) D178.2(C2) D179.2(C2) D180.2(C2) D181.2(C2) D182.2(C2) D183.2(C2) D184.2(C2) D185.2(C2) D186.2(C2) D187.2(C2) D188.2(C2) D189.2(C2) D190.2(C2) D191.2(C2) D192.2(C2) ; also sheet 2,4
ROW7_SINK: D209.1(A1) D210.1(A1) D211.1(A1) D212.1(A1) D213.1(A1) D214.1(A1) D215.1(A1) D216.1(A1) D217.1(A1) D218.1(A1) D219.1(A1) D220.1(A1) D221.1(A1) D222.1(A1) D223.1(A1) D224.1(A1) ; also sheet 2,4
ROW7_SOURCE: D209.2(C2) D210.2(C2) D211.2(C2) D212.2(C2) D213.2(C2) D214.2(C2) D215.2(C2) D216.2(C2) D217.2(C2) D218.2(C2) D219.2(C2) D220.2(C2) D221.2(C2) D222.2(C2) D223.2(C2) D224.2(C2) ; also sheet 2,4
ROW8_SINK: D241.1(A1) D242.1(A1) D243.1(A1) D244.1(A1) D245.1(A1) D246.1(A1) D247.1(A1) D248.1(A1) D249.1(A1) D250.1(A1) D251.1(A1) D252.1(A1) D253.1(A1) D254.1(A1) D255.1(A1) D256.1(A1) ; also sheet 2,4
ROW8_SOURCE: D241.2(C2) D242.2(C2) D243.2(C2) D244.2(C2) D245.2(C2) D246.2(C2) D247.2(C2) D248.2(C2) D249.2(C2) D250.2(C2) D251.2(C2) D252.2(C2) D253.2(C2) D254.2(C2) D255.2(C2) D256.2(C2) ; also sheet 2,4
ROW9_SINK: D273.1(A1) D274.1(A1) D275.1(A1) D276.1(A1) D277.1(A1) D278.1(A1) D279.1(A1) D280.1(A1) D281.1(A1) D282.1(A1) D283.1(A1) D284.1(A1) D285.1(A1) D286.1(A1) D287.1(A1) D288.1(A1) ; also sheet 2,4
ROW9_SOURCE: D273.2(C2) D274.2(C2) D275.2(C2) D276.2(C2) D277.2(C2) D278.2(C2) D279.2(C2) D280.2(C2) D281.2(C2) D282.2(C2) D283.2(C2) D284.2(C2) D285.2(C2) D286.2(C2) D287.2(C2) D288.2(C2) ; also sheet 2,4
ROW10_SINK: D305.1(A1) D306.1(A1) D307.1(A1) D308.1(A1) D309.1(A1) D310.1(A1) D311.1(A1) D312.1(A1) D313.1(A1) D314.1(A1) D315.1(A1) D316.1(A1) D317.1(A1) D318.1(A1) D319.1(A1) D320.1(A1) ; also sheet 2,4
ROW10_SOURCE: D305.2(C2) D306.2(C2) D307.2(C2) D308.2(C2) D309.2(C2) D310.2(C2) D311.2(C2) D312.2(C2) D313.2(C2) D314.2(C2) D315.2(C2) D316.2(C2) D317.2(C2) D318.2(C2) D319.2(C2) D320.2(C2) ; also sheet 2,4
ROW11_SINK: D337.1(A1) D338.1(A1) D339.1(A1) D340.1(A1) D341.1(A1) D342.1(A1) D343.1(A1) D344.1(A1) D345.1(A1) D346.1(A1) D347.1(A1) D348.1(A1) D349.1(A1) D350.1(A1) D351.1(A1) D352.1(A1) ; also sheet 2,4
ROW11_SOURCE: D337.2(C2) D338.2(C2) D339.2(C2) D340.2(C2) D341.2(C2) D342.2(C2) D343.2(C2) D344.2(C2) D345.2(C2) D346.2(C2) D347.2(C2) D348.2(C2) D349.2(C2) D350.2(C2) D351.2(C2) D352.2(C2) ; also sheet 2,4
ROW12_SINK: D369.1(A1) D370.1(A1) D371.1(A1) D372.1(A1) D373.1(A1) D374.1(A1) D375.1(A1) D376.1(A1) D377.1(A1) D378.1(A1) D379.1(A1) D380.1(A1) D381.1(A1) D382.1(A1) D383.1(A1) D384.1(A1) ; also sheet 2,4
ROW12_SOURCE: D369.2(C2) D370.2(C2) D371.2(C2) D372.2(C2) D373.2(C2) D374.2(C2) D375.2(C2) D376.2(C2) D377.2(C2) D378.2(C2) D379.2(C2) D380.2(C2) D381.2(C2) D382.2(C2) D383.2(C2) D384.2(C2) ; also sheet 2,4
ROW13_SINK: D401.1(A1) D402.1(A1) D403.1(A1) D404.1(A1) D405.1(A1) D406.1(A1) D407.1(A1) D408.1(A1) D409.1(A1) D410.1(A1) D411.1(A1) D412.1(A1) D413.1(A1) D414.1(A1) D415.1(A1) D416.1(A1) ; also sheet 2,4
ROW13_SOURCE: D401.2(C2) D402.2(C2) D403.2(C2) D404.2(C2) D405.2(C2) D406.2(C2) D407.2(C2) D408.2(C2) D409.2(C2) D410.2(C2) D411.2(C2) D412.2(C2) D413.2(C2) D414.2(C2) D415.2(C2) D416.2(C2) ; also sheet 2,4
ROW14_SINK: D433.1(A1) D434.1(A1) D435.1(A1) D436.1(A1) D437.1(A1) D438.1(A1) D439.1(A1) D440.1(A1) D441.1(A1) D442.1(A1) D443.1(A1) D444.1(A1) D445.1(A1) D446.1(A1) D447.1(A1) D448.1(A1) ; also sheet 2,4
ROW14_SOURCE: D433.2(C2) D434.2(C2) D435.2(C2) D436.2(C2) D437.2(C2) D438.2(C2) D439.2(C2) D440.2(C2) D441.2(C2) D442.2(C2) D443.2(C2) D444.2(C2) D445.2(C2) D446.2(C2) D447.2(C2) D448.2(C2) ; also sheet 2,4
ROW15_SINK: D465.1(A1) D466.1(A1) D467.1(A1) D468.1(A1) D469.1(A1) D470.1(A1) D471.1(A1) D472.1(A1) D473.1(A1) D474.1(A1) D475.1(A1) D476.1(A1) D477.1(A1) D478.1(A1) D479.1(A1) D480.1(A1) ; also sheet 2,4
ROW15_SOURCE: D465.2(C2) D466.2(C2) D467.2(C2) D468.2(C2) D469.2(C2) D470.2(C2) D471.2(C2) D472.2(C2) D473.2(C2) D474.2(C2) D475.2(C2) D476.2(C2) D477.2(C2) D478.2(C2) D479.2(C2) D480.2(C2) ; also sheet 2,4
ROW16_SINK: D497.1(A1) D498.1(A1) D499.1(A1) D500.1(A1) D501.1(A1) D502.1(A1) D503.1(A1) D504.1(A1) D505.1(A1) D506.1(A1) D507.1(A1) D508.1(A1) D509.1(A1) D510.1(A1) D511.1(A1) D512.1(A1) ; also sheet 2,4
ROW16_SOURCE: D497.2(C2) D498.2(C2) D499.2(C2) D500.2(C2) D501.2(C2) D502.2(C2) D503.2(C2) D504.2(C2) D505.2(C2) D506.2(C2) D507.2(C2) D508.2(C2) D509.2(C2) D510.2(C2) D511.2(C2) D512.2(C2) ; also sheet 2,4